# Altium project BlinkBoard.PrjPcb
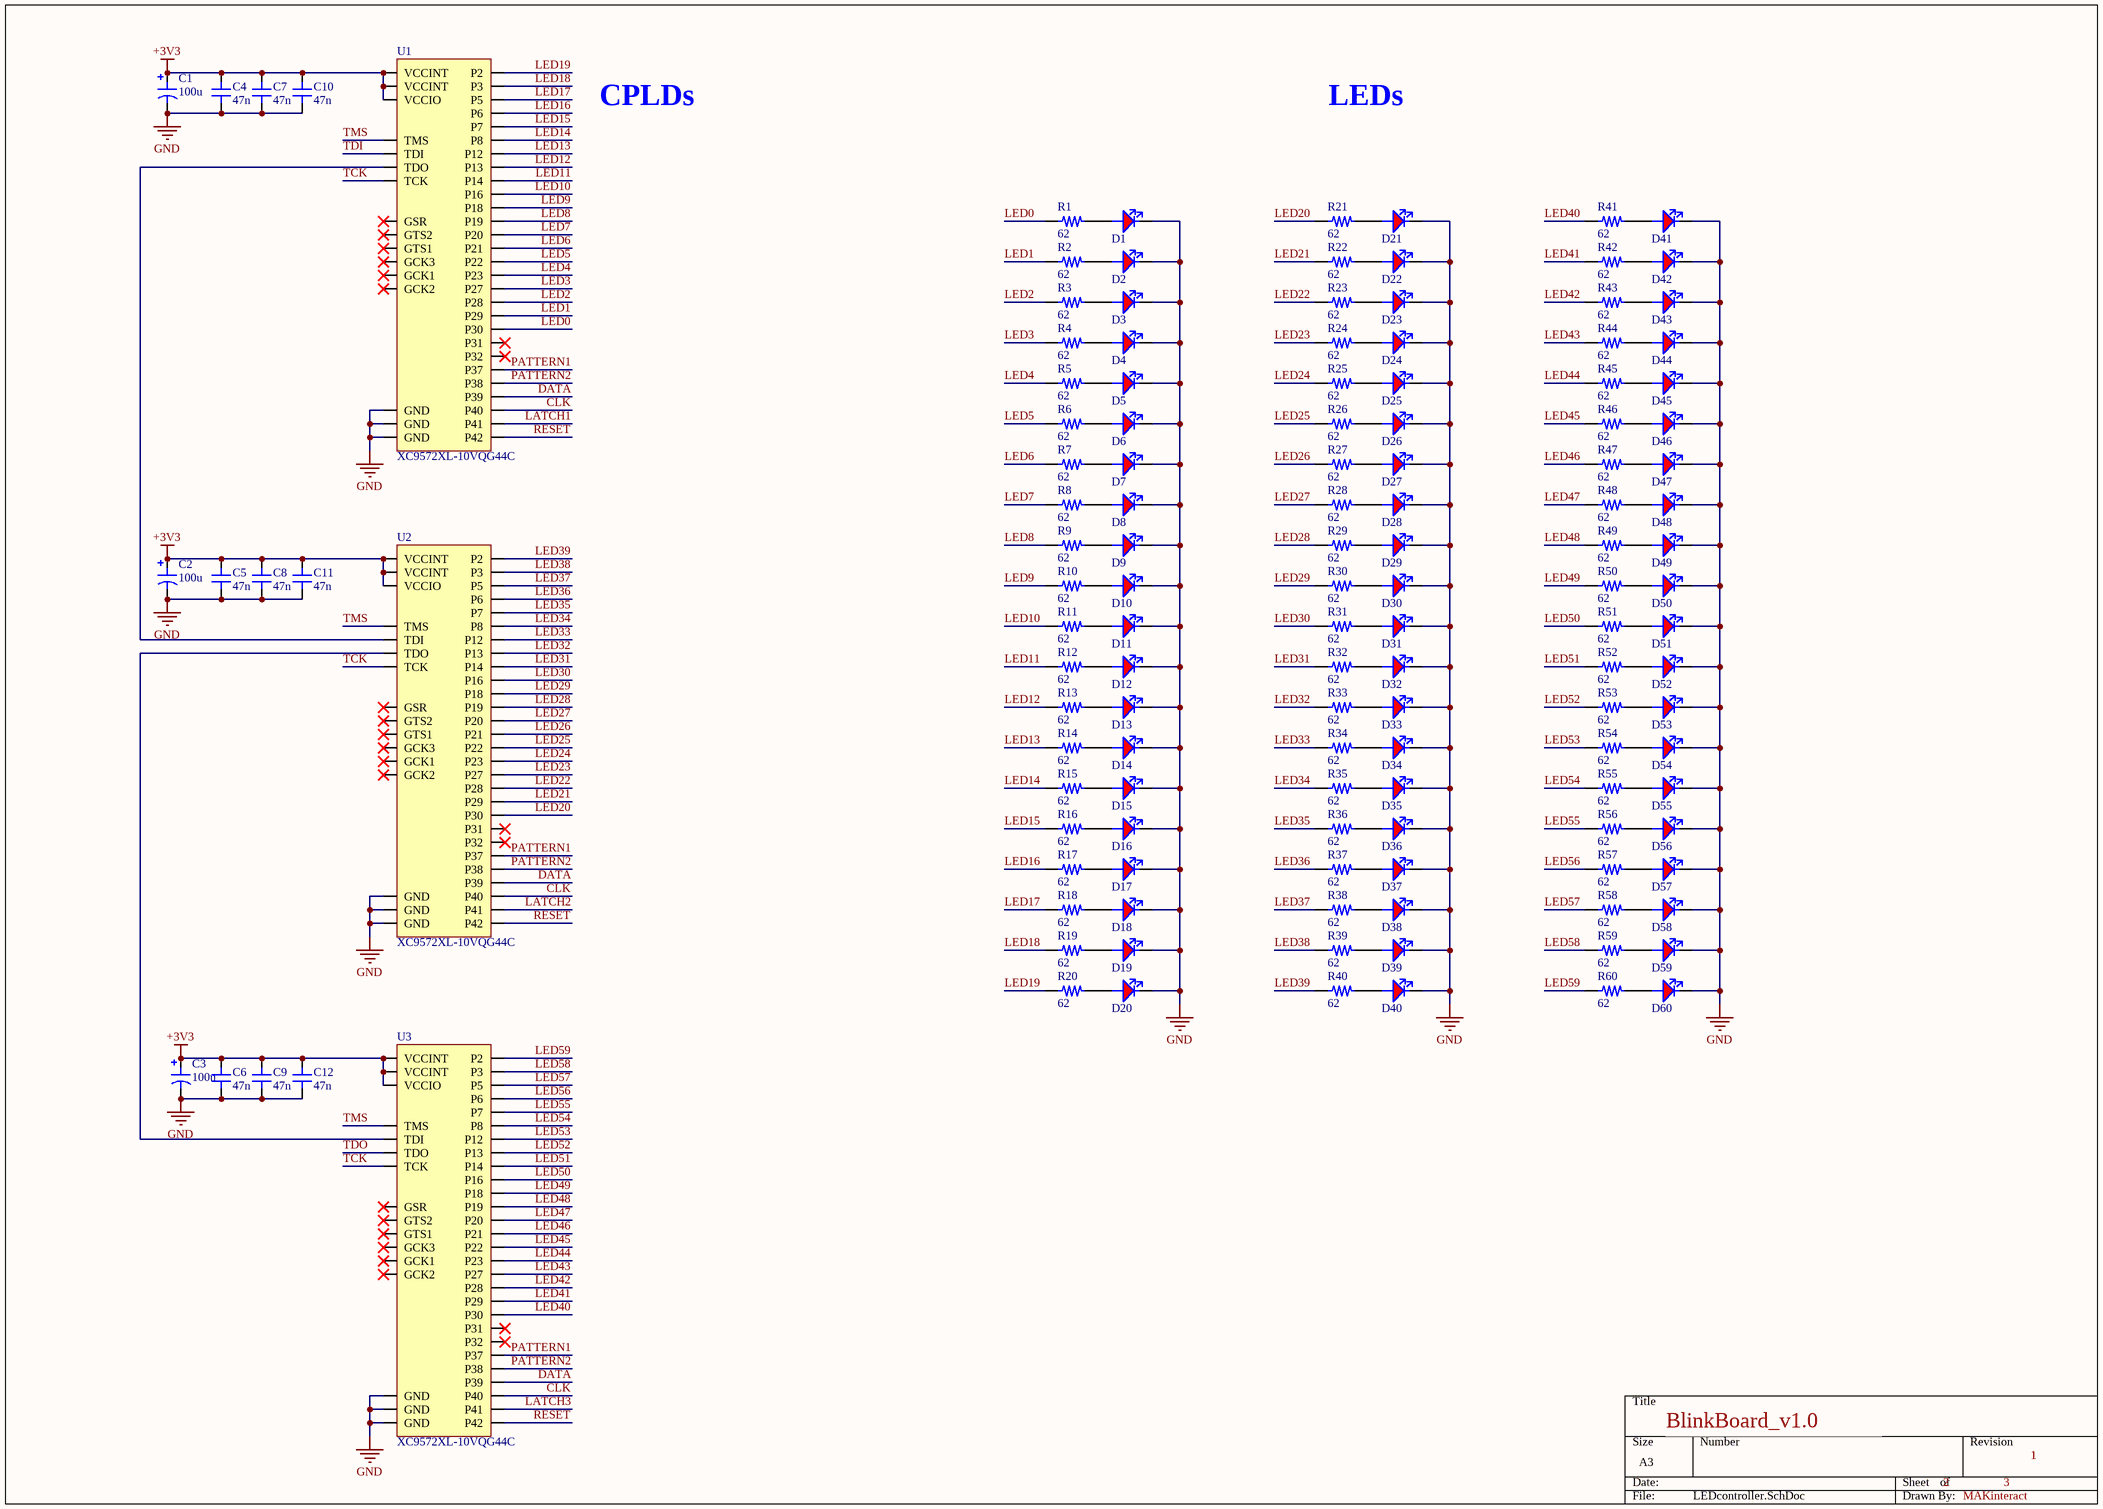
[diagram p0: LEDcontroller.SchDoc]
2 sheets, 155 parts. Net scope: global (net labels, ports and power ports of the same name join across sheets).
Board file: BlinkBoard.PcbDoc
Sheets:
  LEDcontroller.SchDoc
  BlinkBoard.SchDoc

## Sheet LEDcontroller.SchDoc
size A3; Author: MAKinteract; Revision: 1; SheetNumber: 2; SheetTotal: 3

### Parts
C1  100u  [C1206]
C2  100u  [C1206]
C3  100u  [C1206]
C4  47n  [C0805]
C5  47n  [C0805]
C6  47n  [C0805]
C7  47n  [C0805]
C8  47n  [C0805]
C9  47n  [C0805]
C10  47n  [C0805]
C11  47n  [C0805]
C12  47n  [C0805]
D1  LED0402_RED  [LED0402]  (value not drawn)
D2  LED0402_RED  [LED0402]  (value not drawn)
D3  LED0402_RED  [LED0402]  (value not drawn)
D4  LED0402_RED  [LED0402]  (value not drawn)
D5  LED0402_RED  [LED0402]  (value not drawn)
D6  LED0402_RED  [LED0402]  (value not drawn)
D7  LED0402_RED  [LED0402]  (value not drawn)
D8  LED0402_RED  [LED0402]  (value not drawn)
D9  LED0402_RED  [LED0402]  (value not drawn)
D10  LED0402_RED  [LED0402]  (value not drawn)
D11  LED0402_RED  [LED0402]  (value not drawn)
D12  LED0402_RED  [LED0402]  (value not drawn)
D13  LED0402_RED  [LED0402]  (value not drawn)
D14  LED0402_RED  [LED0402]  (value not drawn)
D15  LED0402_RED  [LED0402]  (value not drawn)
D16  LED0402_RED  [LED0402]  (value not drawn)
D17  LED0402_RED  [LED0402]  (value not drawn)
D18  LED0402_RED  [LED0402]  (value not drawn)
D19  LED0402_RED  [LED0402]  (value not drawn)
D20  LED0402_RED  [LED0402]  (value not drawn)
D21  LED0402_RED  [LED0402]  (value not drawn)
D22  LED0402_RED  [LED0402]  (value not drawn)
D23  LED0402_RED  [LED0402]  (value not drawn)
D24  LED0402_RED  [LED0402]  (value not drawn)
D25  LED0402_RED  [LED0402]  (value not drawn)
D26  LED0402_RED  [LED0402]  (value not drawn)
D27  LED0402_RED  [LED0402]  (value not drawn)
D28  LED0402_RED  [LED0402]  (value not drawn)
D29  LED0402_RED  [LED0402]  (value not drawn)
D30  LED0402_RED  [LED0402]  (value not drawn)
D31  LED0402_RED  [LED0402]  (value not drawn)
D32  LED0402_RED  [LED0402]  (value not drawn)
D33  LED0402_RED  [LED0402]  (value not drawn)
D34  LED0402_RED  [LED0402]  (value not drawn)
D35  LED0402_RED  [LED0402]  (value not drawn)
D36  LED0402_RED  [LED0402]  (value not drawn)
D37  LED0402_RED  [LED0402]  (value not drawn)
D38  LED0402_RED  [LED0402]  (value not drawn)
D39  LED0402_RED  [LED0402]  (value not drawn)
D40  LED0402_RED  [LED0402]  (value not drawn)
D41  LED0402_RED  [LED0402]  (value not drawn)
D42  LED0402_RED  [LED0402]  (value not drawn)
D43  LED0402_RED  [LED0402]  (value not drawn)
D44  LED0402_RED  [LED0402]  (value not drawn)
D45  LED0402_RED  [LED0402]  (value not drawn)
D46  LED0402_RED  [LED0402]  (value not drawn)
D47  LED0402_RED  [LED0402]  (value not drawn)
D48  LED0402_RED  [LED0402]  (value not drawn)
D49  LED0402_RED  [LED0402]  (value not drawn)
D50  LED0402_RED  [LED0402]  (value not drawn)
D51  LED0402_RED  [LED0402]  (value not drawn)
D52  LED0402_RED  [LED0402]  (value not drawn)
D53  LED0402_RED  [LED0402]  (value not drawn)
D54  LED0402_RED  [LED0402]  (value not drawn)
D55  LED0402_RED  [LED0402]  (value not drawn)
D56  LED0402_RED  [LED0402]  (value not drawn)
D57  LED0402_RED  [LED0402]  (value not drawn)
D58  LED0402_RED  [LED0402]  (value not drawn)
D59  LED0402_RED  [LED0402]  (value not drawn)
D60  LED0402_RED  [LED0402]  (value not drawn)
R1  62  [RES0402]
R2  62  [RES0402]
R3  62  [RES0402]
R4  62  [RES0402]
R5  62  [RES0402]
R6  62  [RES0402]
R7  62  [RES0402]
R8  62  [RES0402]
R9  62  [RES0402]
R10  62  [RES0402]
R11  62  [RES0402]
R12  62  [RES0402]
R13  62  [RES0402]
R14  62  [RES0402]
R15  62  [RES0402]
R16  62  [RES0402]
R17  62  [RES0402]
R18  62  [RES0402]
R19  62  [RES0402]
R20  62  [RES0402]
R21  62  [RES0402]
R22  62  [RES0402]
R23  62  [RES0402]
R24  62  [RES0402]
R25  62  [RES0402]
R26  62  [RES0402]
R27  62  [RES0402]
R28  62  [RES0402]
R29  62  [RES0402]
R30  62  [RES0402]
R31  62  [RES0402]
R32  62  [RES0402]
R33  62  [RES0402]
R34  62  [RES0402]
R35  62  [RES0402]
R36  62  [RES0402]
R37  62  [RES0402]
R38  62  [RES0402]
R39  62  [RES0402]
R40  62  [RES0402]
R41  62  [RES0402]
R42  62  [RES0402]
R43  62  [RES0402]
R44  62  [RES0402]
R45  62  [RES0402]
R46  62  [RES0402]
R47  62  [RES0402]
R48  62  [RES0402]
R49  62  [RES0402]
R50  62  [RES0402]
R51  62  [RES0402]
R52  62  [RES0402]
R53  62  [RES0402]
R54  62  [RES0402]
R55  62  [RES0402]
R56  62  [RES0402]
R57  62  [RES0402]
R58  62  [RES0402]
R59  62  [RES0402]
R60  62  [RES0402]
U1  XC9572XL-10VQG44C  [VQFP44]
U2  XC9572XL-10VQG44C  [VQFP44]
U3  XC9572XL-10VQG44C  [VQFP44]

### Nets
+3V3: C1.2 C2.2 C3.2 C4.2 C5.2 C6.2 C7.2 C8.2 C9.2 C10.2 C11.2 C12.2 U1.15(VCCINT) U1.26(VCCIO) U1.35(VCCINT) U2.15(VCCINT) U2.26(VCCIO) U2.35(VCCINT) U3.15(VCCINT) U3.26(VCCIO) U3.35(VCCINT)
GND: C1.1 C2.1 C3.1 C4.1 C5.1 C6.1 C7.1 C8.1 C9.1 C10.1 C11.1 C12.1 D1.2(K) D2.2(K) D3.2(K) D4.2(K) D5.2(K) D6.2(K) D7.2(K) D8.2(K) D9.2(K) D10.2(K) D11.2(K) D12.2(K) D13.2(K) D14.2(K) D15.2(K) D16.2(K) D17.2(K) D18.2(K) D19.2(K) D20.2(K) D21.2(K) D22.2(K) D23.2(K) D24.2(K) D25.2(K) D26.2(K) D27.2(K) D28.2(K) D29.2(K) D30.2(K) D31.2(K) D32.2(K) D33.2(K) D34.2(K) D35.2(K) D36.2(K) D37.2(K) D38.2(K) D39.2(K) D40.2(K) D41.2(K) D42.2(K) D43.2(K) D44.2(K) D45.2(K) D46.2(K) D47.2(K) D48.2(K) D49.2(K) D50.2(K) D51.2(K) D52.2(K) D53.2(K) D54.2(K) D55.2(K) D56.2(K) D57.2(K) D58.2(K) D59.2(K) D60.2(K) U1.4(GND) U1.17(GND) U1.25(GND) U2.4(GND) U2.17(GND) U2.25(GND) U3.4(GND) U3.17(GND) U3.25(GND)
CLK: U1.40(P40) U2.40(P40) U3.40(P40)
DATA: U1.39(P39) U2.39(P39) U3.39(P39)
LATCH1: U1.41(P41)
LATCH2: U2.41(P41)
LATCH3: U3.41(P41)
LED0: R1.1 U1.30(P30)
LED1: R2.1 U1.29(P29)
LED2: R3.1 U1.28(P28)
LED3: R4.1 U1.27(P27)
LED4: R5.1 U1.23(P23)
LED5: R6.1 U1.22(P22)
LED6: R7.1 U1.21(P21)
LED7: R8.1 U1.20(P20)
LED8: R9.1 U1.19(P19)
LED9: R10.1 U1.18(P18)
LED10: R11.1 U1.16(P16)
LED11: R12.1 U1.14(P14)
LED12: R13.1 U1.13(P13)
LED13: R14.1 U1.12(P12)
LED14: R15.1 U1.8(P8)
LED15: R16.1 U1.7(P7)
LED16: R17.1 U1.6(P6)
LED17: R18.1 U1.5(P5)
LED18: R19.1 U1.3(P3)
LED19: R20.1 U1.2(P2)
LED20: R21.1 U2.30(P30)
LED21: R22.1 U2.29(P29)
LED22: R23.1 U2.28(P28)
LED23: R24.1 U2.27(P27)
LED24: R25.1 U2.23(P23)
LED25: R26.1 U2.22(P22)
LED26: R27.1 U2.21(P21)
LED27: R28.1 U2.20(P20)
LED28: R29.1 U2.19(P19)
LED29: R30.1 U2.18(P18)
LED30: R31.1 U2.16(P16)
LED31: R32.1 U2.14(P14)
LED32: R33.1 U2.13(P13)
LED33: R34.1 U2.12(P12)
LED34: R35.1 U2.8(P8)
LED35: R36.1 U2.7(P7)
LED36: R37.1 U2.6(P6)
LED37: R38.1 U2.5(P5)
LED38: R39.1 U2.3(P3)
LED39: R40.1 U2.2(P2)
LED40: R41.1 U3.30(P30)
LED41: R42.1 U3.29(P29)
LED42: R43.1 U3.28(P28)
LED43: R44.1 U3.27(P27)
LED44: R45.1 U3.23(P23)
LED45: R46.1 U3.22(P22)
LED46: R47.1 U3.21(P21)
LED47: R48.1 U3.20(P20)
LED48: R49.1 U3.19(P19)
LED49: R50.1 U3.18(P18)
LED50: R51.1 U3.16(P16)
LED51: R52.1 U3.14(P14)
LED52: R53.1 U3.13(P13)
LED53: R54.1 U3.12(P12)
LED54: R55.1 U3.8(P8)
LED55: R56.1 U3.7(P7)
LED56: R57.1 U3.6(P6)
LED57: R58.1 U3.5(P5)
LED58: R59.1 U3.3(P3)
LED59: R60.1 U3.2(P2)
PATTERN1: U1.37(P37) U2.37(P37) U3.37(P37)
PATTERN2: U1.38(P38) U2.38(P38) U3.38(P38)
RESET: U1.42(P42) U2.42(P42) U3.42(P42)
TCK: U1.11(TCK) U2.11(TCK) U3.11(TCK)
TDI: U1.9(TDI)
TDO: U3.24(TDO)
TMS: U1.10(TMS) U2.10(TMS) U3.10(TMS)
NetD1_1: D1.1(A) R1.2
NetD2_1: D2.1(A) R2.2
NetD3_1: D3.1(A) R3.2
NetD4_1: D4.1(A) R4.2
NetD5_1: D5.1(A) R5.2
NetD6_1: D6.1(A) R6.2
NetD7_1: D7.1(A) R7.2
NetD8_1: D8.1(A) R8.2
NetD9_1: D9.1(A) R9.2
NetD10_1: D10.1(A) R10.2
NetD11_1: D11.1(A) R11.2
NetD12_1: D12.1(A) R12.2
NetD13_1: D13.1(A) R13.2
NetD14_1: D14.1(A) R14.2
NetD15_1: D15.1(A) R15.2
NetD16_1: D16.1(A) R16.2
NetD17_1: D17.1(A) R17.2
NetD18_1: D18.1(A) R18.2
NetD19_1: D19.1(A) R19.2
NetD20_1: D20.1(A) R20.2
NetD21_1: D21.1(A) R21.2
NetD22_1: D22.1(A) R22.2
NetD23_1: D23.1(A) R23.2
NetD24_1: D24.1(A) R24.2
NetD25_1: D25.1(A) R25.2
NetD26_1: D26.1(A) R26.2
NetD27_1: D27.1(A) R27.2
NetD28_1: D28.1(A) R28.2
NetD29_1: D29.1(A) R29.2
NetD30_1: D30.1(A) R30.2
NetD31_1: D31.1(A) R31.2
NetD32_1: D32.1(A) R32.2
NetD33_1: D33.1(A) R33.2
NetD34_1: D34.1(A) R34.2
NetD35_1: D35.1(A) R35.2
NetD36_1: D36.1(A) R36.2
NetD37_1: D37.1(A) R37.2
NetD38_1: D38.1(A) R38.2
NetD39_1: D39.1(A) R39.2
NetD40_1: D40.1(A) R40.2
NetD41_1: D41.1(A) R41.2
NetD42_1: D42.1(A) R42.2
NetD43_1: D43.1(A) R43.2
NetD44_1: D44.1(A) R44.2
NetD45_1: D45.1(A) R45.2
NetD46_1: D46.1(A) R46.2
NetD47_1: D47.1(A) R47.2
NetD48_1: D48.1(A) R48.2
NetD49_1: D49.1(A) R49.2
NetD50_1: D50.1(A) R50.2
NetD51_1: D51.1(A) R51.2
NetD52_1: D52.1(A) R52.2
NetD53_1: D53.1(A) R53.2
NetD54_1: D54.1(A) R54.2
NetD55_1: D55.1(A) R55.2
NetD56_1: D56.1(A) R56.2
NetD57_1: D57.1(A) R57.2
NetD58_1: D58.1(A) R58.2
NetD59_1: D59.1(A) R59.2
NetD60_1: D60.1(A) R60.2
NetU1_24: U1.24(TDO) U2.9(TDI)
NetU2_24: U2.24(TDO) U3.9(TDI)

Not connected (* = marked no-connect by the designer): U1 1(GCK3)* 31(P31)* 32(P32)* 33(GSR)* 34(GTS2)* 36(GTS1)* 43(GCK1)* 44(GCK2)*; U2 1(GCK3)* 31(P31)* 32(P32)* 33(GSR)* 34(GTS2)* 36(GTS1)* 43(GCK1)* 44(GCK2)*; U3 1(GCK3)* 31(P31)* 32(P32)* 33(GSR)* 34(GTS2)* 36(GTS1)* 43(GCK1)* 44(GCK2)*

### Notes on the sheet
- CPLDs
- LEDs
- BlinkBoard_v1.0

### Library data of the parts
C1-C3 = C1206_100u: 100uF Solid MnO2 Tantalum Capacitor,  4 V +/-20%,  T491 Series; Manufacturer: KEMET; Manufacturer Part Number: T491A107M004AT; Tolerance: 20%; ESR (Equivalent Series Resistance): 4R; Voltage Rating: 4V; Leakage Current: 4uA; Dissipation Factor: 30%; Polarity: Polar; Life (Hours): 2000Hour; Supplier 1: Digi-Key; Stock 1: 52740; RoHS: Yes; Mount: Surface Mount,PCB; Case/Package: 1206; Dielectric Material: Tantalum; Case Code (Imperial): 1206; Case Code (Metric): 3216; Min Operating Temperature: -55°C; Max Operating Temperature: 125°C; Capacitance: 100uF; Packaging: Tape and Reel; Package Quantity: 1; Termination: SMD/SMT; Voltage: 4V; Voltage Rating (DC): 4V; Features: General Purpose; Length: 3.2mm; Height: 1.6mm; Width: 1.6mm; Height - Seated (Max): 0.071inch; Lead Pitch: 1.2mm; Depth: 1.6mm; Radiation Hardening: No; REACH SVHC: No SVHC; Lead Free: Lead Free; ComponentLink1URL: https://datasheet.ciiva.com/14103/t491serie-eng-tds-14103975.pdf?src-supplier=Distrelec; ComponentLink1Description: https://datasheet.ciiva.com/14103/t491serie-eng-tds-14103975.pdf?src-supplier=Distrelec; ComponentLink2URL: https://datasheet.ciiva.com/7851/1854511-7851162.pdf?src-supplier=Element14; ComponentLink2Description: https://datasheet.ciiva.com/7851/1854511-7851162.pdf?src-supplier=Element14; ComponentLink3URL: https://datasheet.ciiva.com/14589/70095774-14589211.pdf?src-supplier=Allied+Electronics; ComponentLink3Description: https://datasheet.ciiva.com/14589/70095774-14589211.pdf?src-supplier=Allied+Electronics; ComponentLink4URL: https://datasheet.ciiva.com/258/kem-t2005-t491-258169.pdf?src-supplier=Digi-Key; ComponentLink4Description: https://datasheet.ciiva.com/258/kem-t2005-t491-258169.pdf?src-supplier=Digi-Key; ComponentLink5URL: https://datasheet.ciiva.com/258/kem-t2005-t491-258170.pdf?src-supplier=Digi-Key; ComponentLink5Description: https://datasheet.ciiva.com/258/kem-t2005-t491-258170.pdf?src-supplier=Digi-Key; ComponentLink6URL: https://datasheet.ciiva.com/258/kem-t2005-t491-258171.pdf?src-supplier=Digi-Key; ComponentLink6Description: https://datasheet.ciiva.com/258/kem-t2005-t491-258171.pdf?src-supplier=Digi-Key; ComponentLink7URL: https://datasheet.ciiva.com/46417/1854511-46417596.pdf?src-supplier=Element14; ComponentLink7Description: https://datasheet.ciiva.com/46417/1854511-46417596.pdf?src-supplier=Element14; ComponentLink8URL: https://datasheet.ciiva.com/14606/70095774-14606061.pdf?src-supplier=Allied+Electronics; ComponentLink8Description: https://datasheet.ciiva.com/14606/70095774-14606061.pdf?src-supplier=Allied+Electronics; Supplier Part Number 1: 399-3688-6-ND; Pricing 1: 1 = 0.67000, 10 = 0.47100, 50 = 0.35640, 100 = 0.31040, 500 = 0.22990, 1000 = 0.19542 (USD)
C4-C12 = C0805_47n: Cap Ceramic 0.047uF 50V X7R 5% SMD 0805 125C Paper T/R; Manufacturer: Yageo; Manufacturer Part Number: CC0805JRX7R9BB473; Capacitance: 47nF; Supplier 1: Digi-Key; Stock 1: 8317; RoHS: Yes; Mount: Surface Mount; Case/Package: 0805; Weight: 0.000194oz; Case Code (Imperial): 0805; Case Code (Metric): 2012; Min Operating Temperature: -55°C; Max Operating Temperature: 125°C; Tolerance: 5%; Voltage Rating: 50V; Voltage Rating (DC): 50V; Packaging: Tape and Reel; Dielectric: X7R; Termination: SMD/SMT; Composition: Ceramic; Length: 2mm; Height: 0.85mm; Width: 1.25mm; Thickness: 0.037inch; Depth: 1.25mm; Radiation Hardening: No; Lead Free: Lead Free; Halogen Free: Halogen Free; ComponentLink4URL: https://datasheet.ciiva.com/11587/upy-gphc-x7r-6-3v-to-50v-8-11587207.pdf?src-supplier=Avnet; ComponentLink4Description: https://datasheet.ciiva.com/11587/upy-gphc-x7r-6-3v-to-50v-8-11587207.pdf?src-supplier=Avnet; Supplier Part Number 1: 311-3553-6-ND; Pricing 1: 1 = 0.21000, 10 = 0.14700, 100 = 0.06900, 500 = 0.04838, 1000 = 0.04005 (USD)
D1-D60 = LED0402_RED: Led red; Manufacturer: Everlight; Manufacturer Part Number: EAST1005BA0; Color: Blue; Lens Color: Colorless; Lens Transparency: Clear; Luminous Intensity: 50mcd; Test Current: 5mA; Viewing Angle: 120°; Dominant Wavelength: 471nm; Forward Voltage: 3.3V; Number of LEDs: 1; Forward Current: 30mA; Power Rating: 75mW; Wavelength: 631nm; Lens Style: Rectangular,Square; RoHS: Yes; Mount: Surface Mount; Case/Package: 0402; Packaging: Tape and Reel; Length: 1mm; Height: 0.45mm; Width: 0.5mm; Supplier 1: Digi-Key; Stock 1: 50832; Number of Pins: 2; Case Code (Imperial): 0402; Case Code (Metric): 1005; Min Operating Temperature: -30°C; Max Operating Temperature: 85°C; Package Quantity: 1; Illumination Color: Red; Radiation Hardening: No; Lead Free: Lead Free; REACH SVHC: Unknown; ComponentLink3URL: https://datasheet.ciiva.com/13945/vlmo1500-13945367.pdf?src-supplier=Digi-Key; ComponentLink3Description: https://datasheet.ciiva.com/13945/vlmo1500-13945367.pdf?src-supplier=Digi-Key; Supplier Part Number 1: VLMS1500-GS08DKR-ND; Pricing 1: 1 = 0.48000, 10 = 0.34600, 100 = 0.15360, 500 = 0.10752, 1000 = 0.08832 (USD)
R1-R60 = R0402_62: RES SMD 62 OHM 1% 1/16W 0402; Manufacturer: Yageo; Manufacturer Part Number: RC0402FR-0762RL; Resistance: 62R; Temperature Coefficient: 100ppm/°C; Voltage Rating (DC): 50V; Power Rating: 63mW; Supplier 1: Digi-Key; Stock 1: 193361; RoHS: Yes; Case/Package: 0402; Case Code (Imperial): 0402; Case Code (Metric): 1005; Min Operating Temperature: -55°C; Max Operating Temperature: 155°C; Packaging: Tape and Reel; Tolerance: 1%; Composition: Thick Film; Voltage Rating: 50V; Termination: SMD/SMT; Military Standard: Not; Length: 1mm; Height: 0.35mm; Width: 0.5mm; Depth: 0.5mm; REACH SVHC: Unknown; Lead Free: Lead Free; ComponentLink1URL: https://datasheet.ciiva.com/17086/pyu-rc0402-51-rohs-l-6-r-17086553.pdf?src-supplier=Future+Electronics; ComponentLink1Description: https://datasheet.ciiva.com/17086/pyu-rc0402-51-rohs-l-6-r-17086553.pdf?src-supplier=Future+Electronics; Supplier Part Number 1: 311-62.0LRDKR-ND; Pricing 1: 1 = 0.10000, 10 = 0.01600, 100 = 0.00640, 1000 = 0.00289, 2500 = 0.00251, 5000 = 0.00207 (USD)
U1-U3 = XC9572XL: XILINX - XC9572XL-10VQG44C. - CPLD, 72 MACROCELL, 3.3V, 44VQFP; Propagation Delay: 10ns; Speed Grade: 10; Min Supply Voltage: 3V; Max Supply Voltage: 3.6V; Frequency: 178MHz; Number of Gates: 1600; Number of Logic Blocks (LABs): 4; Number of Macrocells: 72; Number of I/Os: 34; Memory Type: FLASH; Max Frequency: 100MHz; Resistance: 62R; Tolerance: 1%; Temperature Coefficient: 100ppm/°C; Voltage Rating (DC): 50V; Power Rating: 63mW; Supplier 1: Digi-Key; Manufacturer: Xilinx; Manufacturer Part Number: XC9572XL-10VQG44C; Stock 1: 4319; RoHS: Yes; Mount: Surface Mount; Case/Package: TQFP; Number of Pins: 44; Min Operating Temperature: 0°C; Max Operating Temperature: 70°C; Packaging: Tray; Operating Supply Voltage: 3.3V; Package Quantity: 160; Number of Logic Elements/Cells: 4; Termination: SMD/SMT; Turn-On Delay Time: 10ns; Radiation Hardening: No; REACH SVHC: No SVHC; Lead Free: Lead Free; Supplier Part Number 1: 122-1448-ND; Pricing 1: 1 = 3.71000 (USD); Case Code (Imperial): 0402; Case Code (Metric): 1005; Composition: Thick Film; Voltage Rating: 50V; Military Standard: Not; Length: 1mm; Height: 0.35mm; Width: 0.5mm; Depth: 0.5mm; ComponentLink1Description: https://www.xilinx.com/support/documentation/data_sheets/ds057.pdf; ComponentLink1URL: https://www.xilinx.com/support/documentation/data_sheets/ds057.pdf; ComponentLink2Description: https://www.xilinx.com/support/documentation/package_specs/vq44.pdf; ComponentLink2URL: https://www.xilinx.com/support/documentation/package_specs/vq44.pdf

## Sheet BlinkBoard.SchDoc
size A; Author: MAKinteract; Revision: 1; SheetNumber: 1; SheetTotal: 3
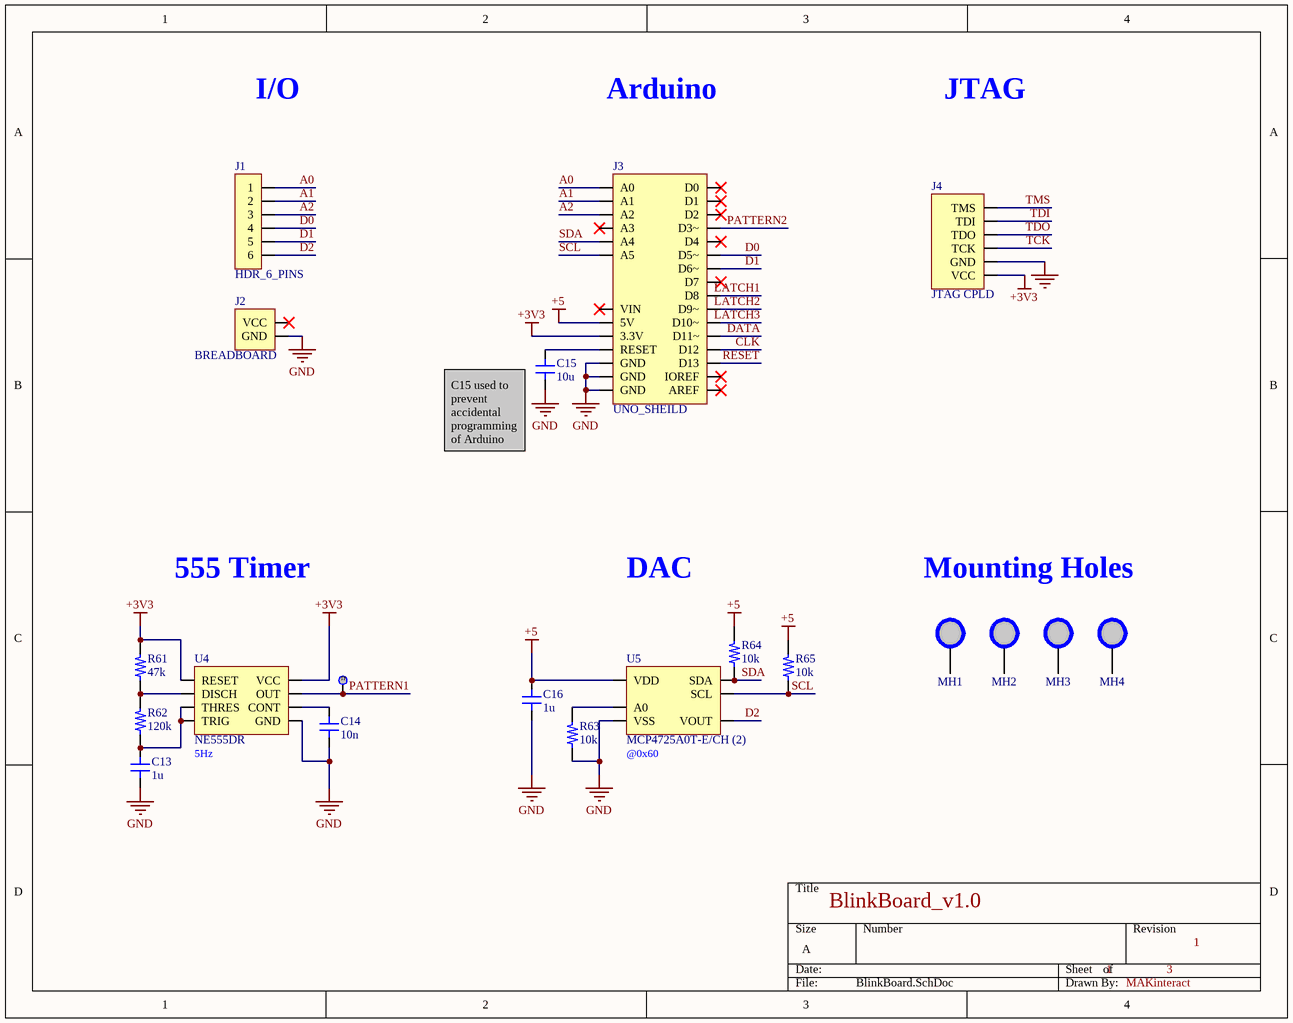
[diagram p1: BlinkBoard.SchDoc]

### Parts
C13  1u  [C0805]
C14  10n  [C0402]
C15  10u  [C0805]
C16  1u  [C0805]
J1  HDR_6_PINS  [HDR6_100mil]  (no BOM)
J2  BREADBOARD  [BREADBOARD]  (no BOM)
J3  UNO_SHEILD  [ARDUINO_UNO_SHIELD]  (no BOM)
J4  JTAG CPLD  [JTAG]  (no BOM)
MH1  MH 3.2mm NP  [MH3.2MM]  (value not drawn)  (no BOM)
MH2  MH 3.2mm NP  [MH3.2MM]  (value not drawn)  (no BOM)
MH3  MH 3.2mm NP  [MH3.2MM]  (value not drawn)  (no BOM)
MH4  MH 3.2mm NP  [MH3.2MM]  (value not drawn)  (no BOM)
R61  47k  [RES0402]
R62  120k  [RES0402]
R63  10k  [RES0402]
R64  10k  [RES0402]
R65  10k  [RES0402]
TP1  TEST POINT  [TEST POINT]  (value not drawn)  (no BOM)
U4  NE555DR  [8-SOIC]
U5  MCP4725A0T-E/CH (2)  [SOT23-6]

### Nets
+3V3: J3.27(3.3V) J4.6(VCC) R61.2 U4.4(RESET) U4.8(VCC)
+5: C16.2 J3.26(5V) R64.2 R65.2 U5.3(VDD)
GND: C13.1 C14.1 C15.1 C16.1 J2.2(GND) J3.15(GND) J3.24(GND) J3.25(GND) J4.5(GND) R63.1 U4.1(GND) U5.2(VSS)
A0: J1.1 J3.22(A0)
A1: J1.2 J3.21(A1)
A2: J1.3 J3.20(A2)
CLK: J3.13(D12)
D0: J1.4 J3.6(D5~)
D1: J1.5 J3.7(D6~)
D2: J1.6 U5.1(VOUT)
DATA: J3.12(D11~)
LATCH1: J3.9(D8)
LATCH2: J3.10(D9~)
LATCH3: J3.11(D10~)
PATTERN1: TP1.1 U4.3(OUT)
PATTERN2: J3.4(D3~)
RESET: J3.14(D13)
SCL: J3.17(A5) R65.1 U5.5(SCL)
SDA: J3.18(A4) R64.1 U5.4(SDA)
TCK: J4.4(TCK)
TDI: J4.2(TDI)
TDO: J4.3(TDO)
TMS: J4.1(TMS)
NetC13_2: C13.2 R62.1 U4.2(TRIG) U4.6(THRES)
NetC14_2: C14.2 U4.5(CONT)
NetC15_2: C15.2 J3.28(RESET)
NetR61_1: R61.1 R62.2 U4.7(DISCH)
NetR63_2: R63.2 U5.6(A0)

Not connected (* = marked no-connect by the designer): J2 1(VCC)*; J3 1(D0)* 2(D1)* 3(D2)* 5(D4)* 8(D7)* 16(AREF)* 19(A3)* 23(VIN)* 29(IOREF)*; MH1 1; MH2 1; MH3 1; MH4 1

### Notes on the sheet
- I/O
- Arduino
- JTAG
- (near C15) C15 used to prevent accidental programming of Arduino
- 555 Timer
- DAC
- Mounting Holes
- (near U4) 5Hz
- (near U5) @0x60
- BlinkBoard_v1.0
- (in symbol TEST POINT) TP

### Library data of the parts
C13 C16 = C0805_1u: CERAMIC CAPACITOR, 1UF, 25V, Y5V, +80, -20%, 0805, FULL REEL; Product Range:CC Series; Capacitance:1 F; Capacitance Tolerance:+80%, -20%; Dielectric Characteristic:Y5V; Voltage Rating:25V; Ceramic Capacitor Case:0805 [2012 Metric] ;RoHS Compliant: Yes; Manufacturer: Yageo; Manufacturer Part Number: CC0805ZRY5V8BB105; Tolerance: 80%; Supplier 1: Digi-Key; Stock 1: 144647; RoHS: Yes; Mount: Surface Mount; Case/Package: 0805; Weight: 0.000194oz; Case Code (Metric): 2012; Case Code (Imperial): 0805; Min Operating Temperature: -30°C; Max Operating Temperature: 85°C; Package Quantity: 1; Capacitance: 1uF; Voltage Rating: 25V; Packaging: Tape and Reel; Voltage Rating (DC): 25V; Dielectric: Y5V; Termination: SMD/SMT; Composition: Ceramic; Length: 2mm; Height: 0.85mm; Width: 0.049inch; Thickness: 0.033inch; Depth: 1.25mm; Radiation Hardening: No; REACH SVHC: No SVHC; Lead Free: Lead Free; Halogen Free: Halogen Free; ComponentLink6URL: https://datasheet.ciiva.com/28450/1132289-28450860.pdf?src-supplier=Element14; ComponentLink6Description: https://datasheet.ciiva.com/28450/1132289-28450860.pdf?src-supplier=Element14; Supplier Part Number 1: 311-1358-6-ND; Pricing 1: 1 = 0.16000, 10 = 0.11400, 100 = 0.05340, 500 = 0.03748, 1000 = 0.03102 (USD)
C14 = C0402_10n: Cap Ceramic 0.01uF 10V X7R 10% SMD 0402 125C Paper T/R; Manufacturer: Yageo; Manufacturer Part Number: CC0402KRX7R6BB103; Capacitance: 10nF; Supplier 1: Digi-Key; Stock 1: 16677; RoHS: Yes; Mount: Surface Mount; Case/Package: 0402; Weight: 2.3E-05oz; Case Code (Imperial): 0402; Case Code (Metric): 1005; Min Operating Temperature: -55°C; Max Operating Temperature: 125°C; Packaging: Tape and Reel; Tolerance: 10%; Voltage Rating (DC): 10V; Dielectric: X7R; Termination: SMD/SMT; Composition: Ceramic; Voltage Rating: 10V; Length: 1mm; Width: 0.02inch; Thickness: 0.022inch; Depth: 0.5mm; Radiation Hardening: No; Lead Free: Lead Free; Halogen Free: Halogen Free; ComponentLink1URL: https://datasheet.ciiva.com/26862/getdatasheetpartid-748492-26862629.pdf?src-supplier=Verical; ComponentLink1Description: https://datasheet.ciiva.com/26862/getdatasheetpartid-748492-26862629.pdf?src-supplier=Verical; Supplier Part Number 1: 311-1703-6-ND; Pricing 1: 1 = 0.10000, 10 = 0.02100, 100 = 0.00950, 500 = 0.00678, 1000 = 0.00532, 2500 = 0.00484, 5000 = 0.00445 (USD)
C15 = C0804_10u: Cap Ceramic 10uF 6.3V X5R 10% SMD 0805 85C Paper T/R; Manufacturer: Yageo; Manufacturer Part Number: CC0805KRX5R5BB106; Supplier 1: Digi-Key; Stock 1: 6744; RoHS: Yes; Mount: Surface Mount; Case/Package: 0805; Case Code (Imperial): 0805; Case Code (Metric): 2012; Min Operating Temperature: -55°C; Max Operating Temperature: 85°C; Capacitance: 10uF; Tolerance: 10%; Voltage Rating: 6.3V; Voltage Rating (DC): 6.3V; Packaging: Tape and Reel; Dissipation Factor: 10%; Dielectric: X5R; Termination: SMD/SMT; Composition: Ceramic; Length: 2mm; Height: 1.25mm; Width: 0.049inch; Thickness: 0.053inch; Depth: 1.25mm; Radiation Hardening: No; Lead Free: Lead Free; Halogen Free: Halogen Free; REACH SVHC: Unknown; ComponentLink1URL: https://datasheet.ciiva.com/17436/upy-gphc-x5r-4v-to-50v-12-17436602.pdf?src-supplier=Avnet+Europe; ComponentLink1Description: https://datasheet.ciiva.com/17436/upy-gphc-x5r-4v-to-50v-12-17436602.pdf?src-supplier=Avnet+Europe; Supplier Part Number 1: 311-2084-6-ND; Pricing 1: 1 = 0.20000, 10 = 0.13600, 50 = 0.08180, 100 = 0.06910, 500 = 0.04730, 1000 = 0.04185 (USD)
J1 = H_ARDUPINS: Sockets to connect to Arduino pins
J2 = BREADBOARD: 26*2 ROWS
J3 = ARDUINO_UNO_SHIELD: Arduino UNO shield; Manufacturer Part Number: A000073; Evaluation Kit: Yes; Number of Bits: 8; Core Architecture: AVR; Supplier 1: Digi-Key; Manufacturer: Arduino; Stock 1: 2726; RoHS: Yes; Mount: Surface Mount; Weight: 0.02lb; Package Quantity: 1; Packaging: Bulk; Length: 3inch; Height: 0.05inch; Width: 2.5inch; REACH SVHC: Unknown; ComponentLink6URL: https://datasheet.ciiva.com/20168/73-4443-20168541.pdf?src-supplier=Rapid+Electronics; ComponentLink6Description: https://datasheet.ciiva.com/20168/73-4443-20168541.pdf?src-supplier=Rapid+Electronics; Supplier Part Number 1: 1050-1041-ND; Pricing 1: 1 = 20.90000 (USD)
J4 = H_JTAG: Socket to connect to JTAG
MH1-MH4 = MHNP: Mounting hole 3.2mm non plated
R61 = R0402_47K: YAGEO - RC0402JR-0747KL - SMD Chip Resistor, 0402 [1005 Metric], 47 kohm, RC Series, 50 V, Thick Film, 63 mW; Resistance: 47kR; Power Rating: 63mW; Tolerance: 5%; Voltage Rating: 50V; Temperature Coefficient: 100ppm/°C; Supplier 1: Digi-Key; Manufacturer: Yageo; Manufacturer Part Number: RC0402JR-0747KL; Stock 1: 4044309; RoHS: Yes; Case/Package: 0402; Case Code (Metric): 1005; Case Code (Imperial): 0402; Min Operating Temperature: -55°C; Max Operating Temperature: 155°C; Package Quantity: 1; Packaging: Tape and Reel; Composition: Thick Film; Number of Terminations: 2; Termination: SMD/SMT; Military Standard: Not; Max Power Dissipation: 63mW; Features: Moisture Resistant; Working Voltage: 50V; Length: 1mm; Height: 0.016inch; Width: 0.02inch; Depth: 0.5mm; REACH SVHC: Unknown; Lead Free: Lead Free; ComponentLink8URL: https://datasheet.ciiva.com/16740/pyu-rc0402-51-rohs-l-6-r-16740971.pdf?src-supplier=Future+Electronics; ComponentLink8Description: https://datasheet.ciiva.com/16740/pyu-rc0402-51-rohs-l-6-r-16740971.pdf?src-supplier=Future+Electronics; Supplier Part Number 1: 311-47KJRDKR-ND; Pricing 1: 1 = 0.10000, 10 = 0.01300, 100 = 0.00530, 1000 = 0.00236, 2500 = 0.00205, 5000 = 0.00169 (USD)
R62 = R0402_120K: RES SMD 120K OHM 5% 1/16W 0402; Manufacturer: Yageo; Manufacturer Part Number: RC0402JR-07120KL; Resistance: 120kR; Power Rating: 63mW; Voltage Rating: 50V; Temperature Coefficient: 100ppm/°C; Supplier 1: Digi-Key; Stock 1: 102829; RoHS: Yes; Case/Package: 0402; Number of Pins: 2; Case Code (Imperial): 0402; Case Code (Metric): 1005; Min Operating Temperature: -55°C; Max Operating Temperature: 155°C; Tolerance: 5%; Packaging: Tape and Reel; Voltage Rating (DC): 50V; Package Quantity: 10000; Termination: SMD/SMT; Composition: Thick Film; Military Standard: Not; Length: 1mm; Height: 0.35mm; Width: 0.5mm; Depth: 0.5mm; REACH SVHC: No SVHC; Lead Free: Lead Free; ComponentLink1URL: https://datasheet.ciiva.com/7850/1018594-7850140.pdf?src-supplier=Element14; ComponentLink1Description: https://datasheet.ciiva.com/7850/1018594-7850140.pdf?src-supplier=Element14; ComponentLink2URL: https://datasheet.ciiva.com/6168/1018594-6168997.pdf?src-supplier=Farnell; ComponentLink2Description: https://datasheet.ciiva.com/6168/1018594-6168997.pdf?src-supplier=Farnell; ComponentLink3URL: https://datasheet.ciiva.com/7983/1018594-7983545.pdf?src-supplier=Element14; ComponentLink3Description: https://datasheet.ciiva.com/7983/1018594-7983545.pdf?src-supplier=Element14; ComponentLink4URL: https://datasheet.ciiva.com/7850/1018594-7850141.pdf?src-supplier=Element14; ComponentLink4Description: https://datasheet.ciiva.com/7850/1018594-7850141.pdf?src-supplier=Element14; ComponentLink5URL: https://datasheet.ciiva.com/12576/pyu-rc0402-51-rohs-l-6-r-8721-12576174.pdf?src-supplier=Mouser; ComponentLink5Description: https://datasheet.ciiva.com/12576/pyu-rc0402-51-rohs-l-6-r-8721-12576174.pdf?src-supplier=Mouser; Supplier Part Number 1: 311-120KJRDKR-ND; Pricing 1: 1 = 0.10000, 10 = 0.01300, 100 = 0.00530, 1000 = 0.00236, 2500 = 0.00205, 5000 = 0.00169 (USD)
R63-R65 = R0402_10K: RES SMD 10K OHM 1% 1/16W 0402; Manufacturer: Yageo; Manufacturer Part Number: RC0402FR-0710KP; Max Power Dissipation: 63mW; Temperature Coefficient: 150ppm/°C; Resistance: 10kR; Supplier 1: Digi-Key; Stock 1: 24916; RoHS: Yes; Case/Package: 0402; Case Code (Imperial): 0402; Case Code (Metric): 1005; Min Operating Temperature: -55°C; Max Operating Temperature: 155°C; Tolerance: 1%; Packaging: Tape and Reel; Composition: Thick Film; Number of Terminations: 2; Features: Moisture Resistant; Length: 0.039inch; Height: 0.016inch; Width: 0.02inch; ComponentLink1URL: http://www.yageo.com/NewPortal/yageodocoutput?fileName=/pdf/R-Chip/PYu-RC_51_RoHS_P_0.pdf&src-supplier=Digi-Key; ComponentLink1Description: http://www.yageo.com/NewPortal/yageodocoutput?fileName=/pdf/R-Chip/PYu-RC_51_RoHS_P_0.pdf&src-supplier=Digi-Key; Supplier Part Number 1: YAG1249DKR-ND; Pricing 1: 1 = 0.10000, 10 = 0.03500, 100 = 0.01400, 1000 = 0.00631, 2500 = 0.00548, 5000 = 0.00452 (USD)
U4 = 555: TEXAS INSTRUMENTS         NE555DR.             TIMER, SINGLE, 500KHZ, 16V, SOIC-8; Min Supply Voltage: 4.5V; Frequency: 100kHz; Number of Timers/Counters: 1; Operating Supply Current: 10mA; High Level Output Current: -200mA; Low Level Output Current: 200mA; Quiescent Current: 15mA; Supplier 1: Digi-Key; Manufacturer: Texas Instruments; Manufacturer Part Number: NE555DR; Stock 1: 55105; RoHS: Yes; Mount: Surface Mount; Case/Package: SOIC; Number of Pins: 8; Weight: 0.002561oz; Contact Plating: Gold; Min Operating Temperature: 0°C; Max Operating Temperature: 70°C; Max Supply Voltage: 16V; Packaging: Tape and Reel; Package Quantity: 2500; Length: 4.9mm; Height: 1.58mm; Width: 3.91mm; Radiation Hardening: No; REACH SVHC: No SVHC; Lead Free: Lead Free; Supplier Part Number 1: 296-6501-6-ND; Pricing 1: 1 = 0.36000, 10 = 0.27500, 25 = 0.24760, 100 = 0.17100, 250 = 0.14400, 500 = 0.11700, 1000 = 0.09000 (USD); ComponentLink7URL: https://datasheet.ciiva.com/1139/1874740-1139901.pdf?src-supplier=Element14; ComponentLink7Description: https://datasheet.ciiva.com/1139/1874740-1139901.pdf?src-supplier=Element14
U5 = MCP4725A0T: DAC 1-CH Resistor-String 12-bit 6-Pin SOT-23A T/R; Manufacturer: Microchip; Resolution: 12b; Integral Nonlinearity (INL): 14.5LSB; Output Type: Voltage; Interface: I2C,Serial,2-Wire; Settling Time: 6us; Input Offset Voltage (Vos): 1.1mV; Number of Bits: 12; Number of DAC Channels: 1; Max Supply Voltage: 5.5V; Min Supply Voltage: 2.7V; Polarity: Unipolar; Supply Type: Single; Nominal Supply Current: 210uA; Supplier 1: Digi-Key; Manufacturer Part Number: MCP4725A0T-E/CH; Stock 1: 26487; RoHS: Yes; Mount: Surface Mount; Case/Package: SOT-23-6; Number of Pins: 6; Contact Plating: Tin,Matte; Min Operating Temperature: -40°C; Max Operating Temperature: 125°C; Package Quantity: 3000; Packaging: Tape and Reel; Number of Converters: 1; Number of Channels: 1; Number of D/A Converters: 1; Number of Outputs: 1; Termination: SMD/SMT; Length: 3.1mm; Height: 1.3mm; Width: 1.8mm; Radiation Hardening: No; Lead Free: Lead Free; REACH SVHC: No SVHC; ComponentLink10URL: https://datasheet.ciiva.com/1359/22039d-1359789.pdf?src-supplier=Digi-Key; ComponentLink10Description: https://datasheet.ciiva.com/1359/22039d-1359789.pdf?src-supplier=Digi-Key; Supplier Part Number 1: MCP4725A0T-E/CHDKR-ND; Pricing 1: 1 = 0.96000, 25 = 0.80000, 100 = 0.73000 (USD)

## Nets that join several sheets
+3V3: LEDcontroller (21 pins), BlinkBoard (5 pins)
GND: LEDcontroller (81 pins), BlinkBoard (12 pins)
CLK: LEDcontroller (U1.40 U2.40 U3.40), BlinkBoard (J3.13)
DATA: LEDcontroller (U1.39 U2.39 U3.39), BlinkBoard (J3.12)
LATCH1: LEDcontroller (U1.41), BlinkBoard (J3.9)
LATCH2: LEDcontroller (U2.41), BlinkBoard (J3.10)
LATCH3: LEDcontroller (U3.41), BlinkBoard (J3.11)
PATTERN1: LEDcontroller (U1.37 U2.37 U3.37), BlinkBoard (TP1.1 U4.3)
PATTERN2: LEDcontroller (U1.38 U2.38 U3.38), BlinkBoard (J3.4)
RESET: LEDcontroller (U1.42 U2.42 U3.42), BlinkBoard (J3.14)
TCK: LEDcontroller (U1.11 U2.11 U3.11), BlinkBoard (J4.4)
TDI: LEDcontroller (U1.9), BlinkBoard (J4.2)
TDO: LEDcontroller (U3.24), BlinkBoard (J4.3)
TMS: LEDcontroller (U1.10 U2.10 U3.10), BlinkBoard (J4.1)